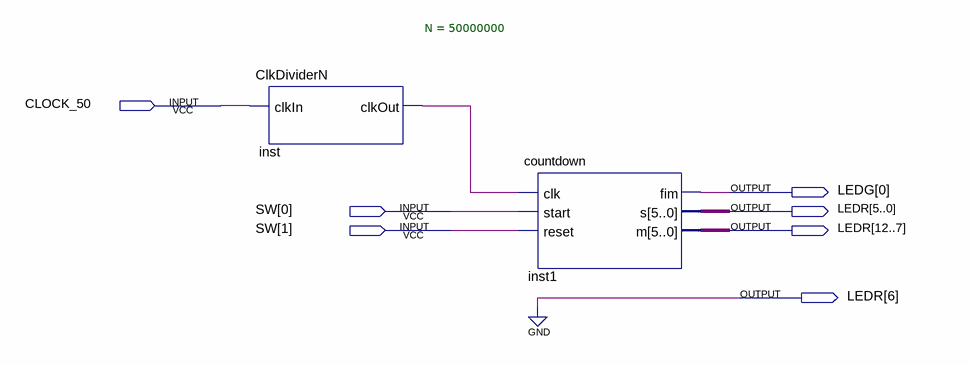
[diagram p0: schematic sheet]
// Quartus schematic Fase1.bdf as structural Verilog: 2 symbols, 7 pins
module Fase1 (
  input  CLOCK_50,
  input  [1:0] SW,
  output [0:0] LEDG,
  output [12:0] LEDR
);

  wire inst_clkout;

  ClkDividerN #(.N(50000000)) inst (.clkIn(CLOCK_50), .clkOut(inst_clkout));
  countdown inst1 (.clk(inst_clkout), .start(SW[0]), .reset(SW[1]), .fim(LEDG[0]), .s(LEDR[5:0]), .m(LEDR[12:7]));

  assign LEDR[6] = 1'b0;
endmodule
